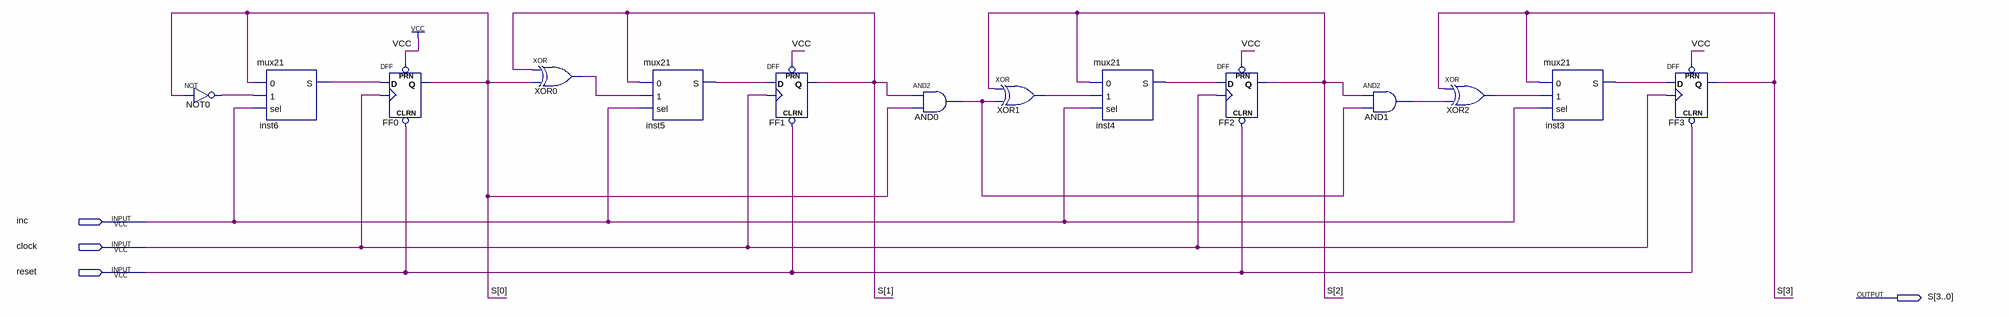
[diagram p0: schematic sheet]
// Quartus schematic reg4b_inc.bdf as structural Verilog: 14 symbols, 4 pins
module reg4b_inc (
  input  inc,
  input  clock,
  input  reset,
  output [3:0] S
);

  wire AND0_out, AND1_out, inst3_s, inst4_s, inst5_s, inst6_s, NOT0_out, XOR0_out, XOR1_out, XOR2_out;

  not NOT0 (NOT0_out, S[0]);
  mux21 inst6 (.\0 (S[0]), .\1 (NOT0_out), .sel(inc), .S(inst6_s));
  DFF FF0 (.CLRN(reset), .CLK(clock), .D(inst6_s), .PRN(1'b1), .Q(S[0]));
  xor XOR0 (XOR0_out, S[1], S[0]);
  mux21 inst5 (.\0 (S[1]), .\1 (XOR0_out), .sel(inc), .S(inst5_s));
  DFF FF1 (.CLRN(reset), .CLK(clock), .D(inst5_s), .PRN(1'b1), .Q(S[1]));
  and AND0 (AND0_out, S[1], S[0]);
  xor XOR1 (XOR1_out, S[2], AND0_out);
  mux21 inst4 (.\0 (S[2]), .\1 (XOR1_out), .sel(inc), .S(inst4_s));
  DFF FF2 (.CLRN(reset), .CLK(clock), .D(inst4_s), .PRN(1'b1), .Q(S[2]));
  and AND1 (AND1_out, S[2], AND0_out);
  xor XOR2 (XOR2_out, S[3], AND1_out);
  mux21 inst3 (.\0 (S[3]), .\1 (XOR2_out), .sel(inc), .S(inst3_s));
  DFF FF3 (.CLRN(reset), .CLK(clock), .D(inst3_s), .PRN(1'b1), .Q(S[3]));
endmodule
